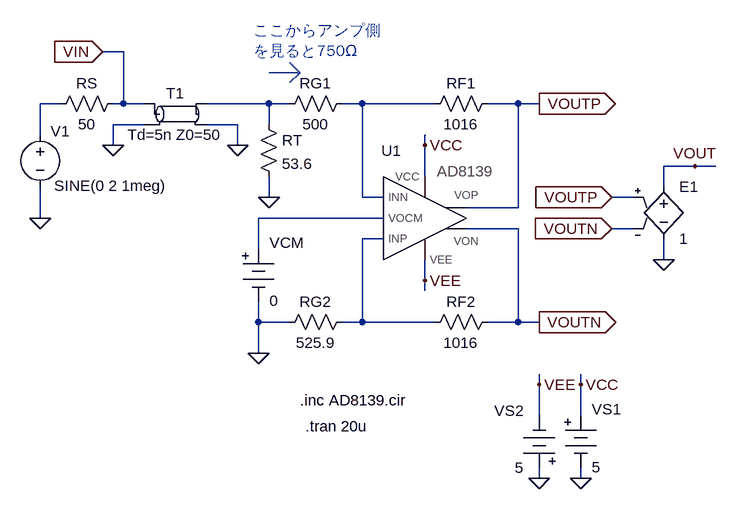
[diagram p0: schematic fig-02-05-22.asc]
fig-02-05-22.asc, the LTspice schematic file:
Version 4
SHEET 1 1332 680
WIRE -208 -208 -240 -208
WIRE -304 -128 -336 -128
WIRE -208 -128 -208 -208
WIRE -208 -128 -224 -128
WIRE -176 -128 -208 -128
WIRE 16 -128 -80 -128
WIRE 48 -128 16 -128
WIRE 160 -128 128 -128
WIRE 272 -128 160 -128
WIRE 400 -128 352 -128
WIRE 432 -128 400 -128
WIRE -176 -96 -224 -96
WIRE -32 -96 -80 -96
WIRE 16 -96 16 -128
WIRE -336 -80 -336 -128
WIRE -224 -64 -224 -96
WIRE -32 -64 -32 -96
WIRE 256 -64 256 -80
WIRE 672 -32 624 -32
WIRE 704 -32 672 -32
WIRE 256 -16 256 -64
WIRE 624 0 624 -32
WIRE 16 16 16 -16
WIRE 160 16 160 -128
WIRE 192 16 160 16
WIRE 576 16 544 16
WIRE 400 32 400 -128
WIRE 400 32 320 32
WIRE -336 48 -336 0
WIRE 192 48 0 48
WIRE 400 64 320 64
WIRE 576 64 544 64
WIRE 192 80 160 80
WIRE 0 96 0 48
WIRE 624 112 624 80
WIRE 256 144 256 112
WIRE 256 160 256 144
WIRE 0 208 0 176
WIRE 48 208 0 208
WIRE 160 208 160 80
WIRE 160 208 128 208
WIRE 272 208 160 208
WIRE 400 208 400 64
WIRE 400 208 352 208
WIRE 432 208 400 208
WIRE 0 256 0 208
WIRE 432 304 432 288
WIRE 496 304 496 288
WIRE 432 352 432 304
WIRE 496 352 496 304
WIRE 432 448 432 432
WIRE 496 448 496 432
FLAG -336 48 0
FLAG 432 -128 VOUTP
IOPIN 432 -128 Out
FLAG 0 256 0
FLAG 432 448 0
FLAG 496 448 0
FLAG 432 304 VEE
FLAG 496 304 VCC
FLAG 256 -64 VCC
FLAG 256 144 VEE
FLAG 432 208 VOUTN
IOPIN 432 208 Out
FLAG -224 -64 0
FLAG 16 16 0
FLAG -32 -64 0
FLAG 624 112 0
FLAG 544 64 VOUTN
IOPIN 544 64 In
FLAG 544 16 VOUTP
IOPIN 544 16 In
FLAG 672 -32 VOUT
FLAG -240 -208 VIN
IOPIN -240 -208 In
SYMBOL res 368 -144 R90
WINDOW 0 0 56 VBottom 2
WINDOW 3 32 56 VTop 2
SYMATTR InstName RF1
SYMATTR Value 1016
SYMBOL res 144 -144 R90
WINDOW 0 0 56 VBottom 2
WINDOW 3 32 56 VTop 2
SYMATTR InstName RG1
SYMATTR Value 500
SYMBOL voltage -336 -96 R0
WINDOW 0 31 26 Bottom 2
WINDOW 3 108 110 Bottom 2
WINDOW 123 35 89 Top 2
WINDOW 39 0 0 Left 0
SYMATTR InstName V1
SYMATTR Value SINE(0 2 1meg)
SYMBOL Misc\\battery 496 336 R0
WINDOW 0 17 6 Left 2
WINDOW 3 17 95 Left 2
WINDOW 123 0 0 Left 0
WINDOW 39 0 0 Left 0
SYMATTR InstName VS1
SYMATTR Value 5
SYMBOL Misc\\battery 432 448 R180
WINDOW 0 24 104 Left 2
WINDOW 3 24 16 Left 2
WINDOW 123 0 0 Left 0
WINDOW 39 0 0 Left 0
SYMATTR InstName VS2
SYMATTR Value 5
SYMBOL AD8139-sub 256 48 R0
WINDOW 0 -51 -88 Bottom 2
SYMATTR InstName U1
SYMATTR Value AD8139
SYMATTR Prefix X
SYMBOL res 368 192 R90
WINDOW 0 0 56 VBottom 2
WINDOW 3 32 56 VTop 2
SYMATTR InstName RF2
SYMATTR Value 1016
SYMBOL res 144 192 R90
WINDOW 0 0 56 VBottom 2
WINDOW 3 32 56 VTop 2
SYMATTR InstName RG2
SYMATTR Value 525.9
SYMBOL Misc\\battery 0 80 R0
WINDOW 0 17 6 Left 2
WINDOW 3 17 95 Left 2
WINDOW 123 0 0 Left 0
WINDOW 39 0 0 Left 0
SYMATTR InstName VCM
SYMATTR Value 0
SYMBOL tline -128 -112 R0
SYMATTR InstName T1
SYMATTR Value Td=5n Z0=50
SYMBOL res -208 -144 R90
WINDOW 0 0 56 VBottom 2
WINDOW 3 32 56 VTop 2
SYMATTR InstName RS
SYMATTR Value 50
SYMBOL res 0 -112 R0
SYMATTR InstName RT
SYMATTR Value 53.6
SYMBOL e 624 -16 R0
SYMATTR InstName E1
SYMATTR Value 1
TEXT 64 328 Left 2 !.inc AD8139.cir
TEXT 72 368 Left 2 !.tran 20u
TEXT -8 -240 Left 2 ;ここからアンプ側\nを見ると750Ω
LINE Normal 64 -176 16 -176
LINE Normal 64 -176 48 -192
LINE Normal 48 -160 64 -176

The netlist it stands for:
* fig-02-05-22.asc
RF1 VOUTP N003 1016
RG1 N003 N002 500
V1 N001 0 SINE(0 2 1meg)
VS1 VCC 0 5
VS2 0 VEE 5
XU1 N003 N004 VCC VOUTP VOUTN VEE N005 AD8139-sub params: AD8139  ; pins INN VOCM VCC VOP VON VEE INP
RF2 VOUTN N005 1016
RG2 N005 0 525.9
VCM N004 0 0
T1 VIN 0 N002 0 Td=5n Z0=50
RS VIN N001 50
RT N002 0 53.6
E1 VOUT 0 VOUTP VOUTN 1
.inc AD8139.cir
.tran 20u
* ここからアンプ側
* を見ると750Ω
.backanno
.end